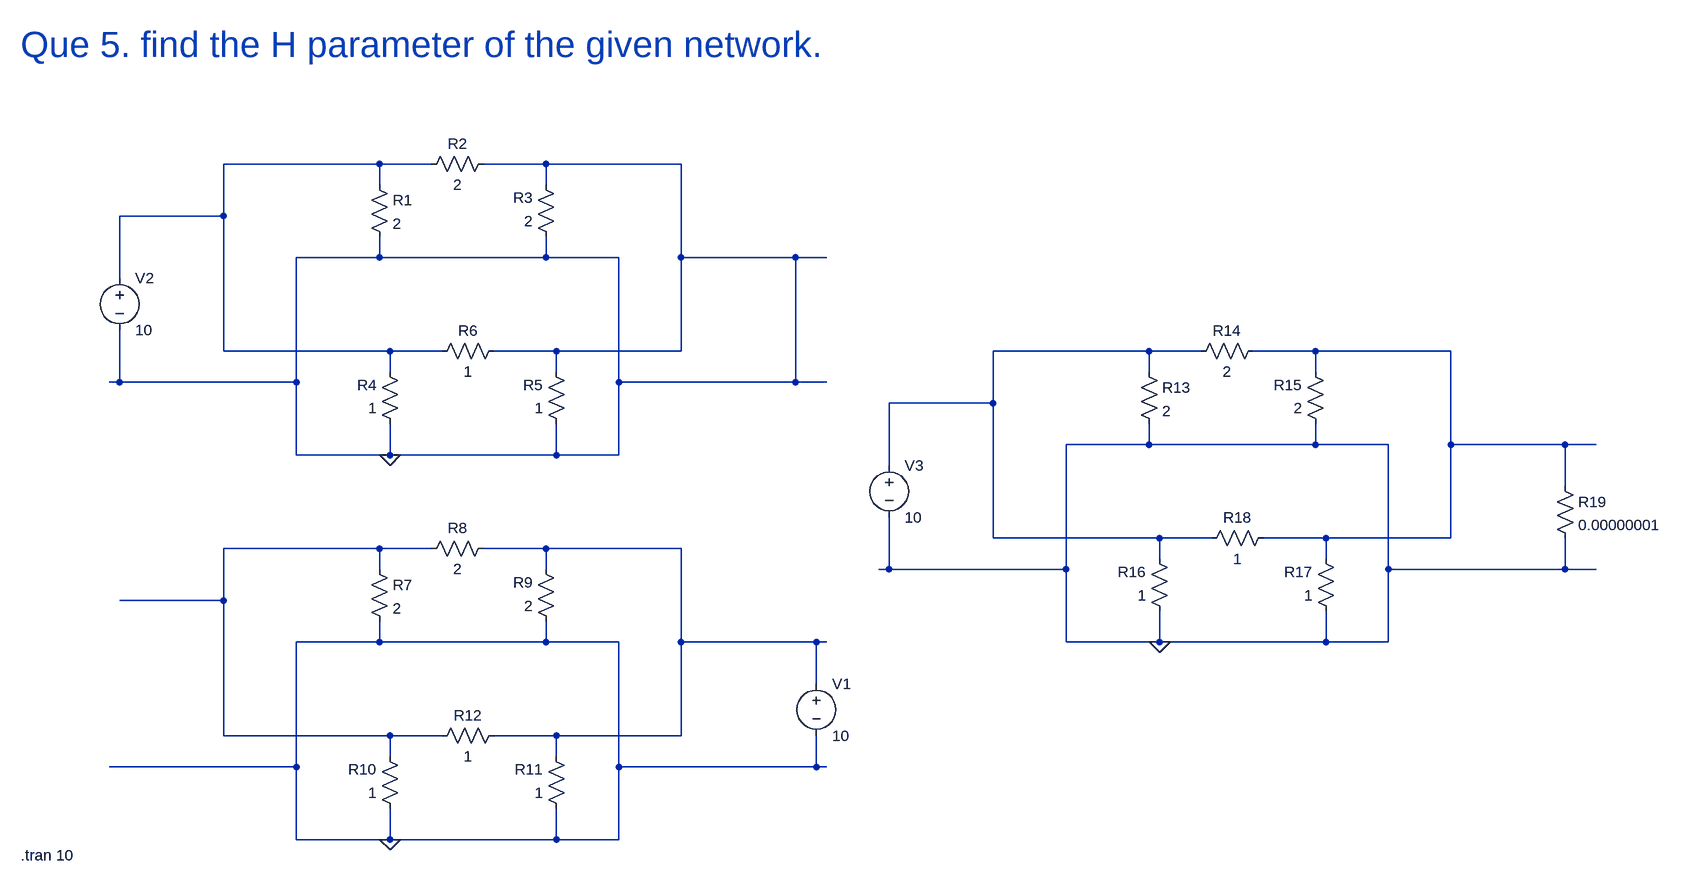
[diagram p0: schematic 5_Dheerendra_23EE019_Two_port_Parallel_H_paramerter.asc]
5_Dheerendra_23EE019_Two_port_Parallel_H_paramerter.asc, the LTspice schematic file:
Version 4
SHEET 1 2020 1048
WIRE 32 -32 -208 -32
WIRE 112 -32 32 -32
WIRE 288 -32 192 -32
WIRE 496 -32 288 -32
WIRE 32 0 32 -32
WIRE 288 0 288 -32
WIRE -208 48 -208 -32
WIRE -208 48 -368 48
WIRE 32 112 32 80
WIRE 32 112 -96 112
WIRE 288 112 288 80
WIRE 288 112 32 112
WIRE 400 112 288 112
WIRE 496 112 496 -32
WIRE 672 112 496 112
WIRE 720 112 672 112
WIRE -368 144 -368 48
WIRE -208 256 -208 48
WIRE 48 256 -208 256
WIRE 128 256 48 256
WIRE 304 256 208 256
WIRE 496 256 496 112
WIRE 496 256 304 256
WIRE 1216 256 976 256
WIRE 1296 256 1216 256
WIRE 1472 256 1376 256
WIRE 1680 256 1472 256
WIRE 48 288 48 256
WIRE 304 288 304 256
WIRE 1216 288 1216 256
WIRE 1472 288 1472 256
WIRE -368 304 -368 224
WIRE -368 304 -384 304
WIRE -96 304 -96 112
WIRE -96 304 -368 304
WIRE 400 304 400 112
WIRE 672 304 672 112
WIRE 672 304 400 304
WIRE 720 304 672 304
WIRE 976 336 976 256
WIRE 976 336 816 336
WIRE 1216 400 1216 368
WIRE 1216 400 1088 400
WIRE 1472 400 1472 368
WIRE 1472 400 1216 400
WIRE 1584 400 1472 400
WIRE 1680 400 1680 256
WIRE 1856 400 1680 400
WIRE 1904 400 1856 400
WIRE -96 416 -96 304
WIRE 48 416 48 368
WIRE 48 416 -96 416
WIRE 304 416 304 368
WIRE 304 416 48 416
WIRE 400 416 400 304
WIRE 400 416 304 416
WIRE 816 432 816 336
WIRE 1856 464 1856 400
WIRE 976 544 976 336
WIRE 1232 544 976 544
WIRE 1312 544 1232 544
WIRE 1488 544 1392 544
WIRE 1680 544 1680 400
WIRE 1680 544 1488 544
WIRE 32 560 -208 560
WIRE 112 560 32 560
WIRE 288 560 192 560
WIRE 496 560 288 560
WIRE 1232 576 1232 544
WIRE 1488 576 1488 544
WIRE 32 592 32 560
WIRE 288 592 288 560
WIRE 816 592 816 512
WIRE 816 592 800 592
WIRE 1088 592 1088 400
WIRE 1088 592 816 592
WIRE 1584 592 1584 400
WIRE 1856 592 1856 544
WIRE 1856 592 1584 592
WIRE 1904 592 1856 592
WIRE -208 640 -208 560
WIRE -208 640 -368 640
WIRE 32 704 32 672
WIRE 32 704 -96 704
WIRE 288 704 288 672
WIRE 288 704 32 704
WIRE 400 704 288 704
WIRE 496 704 496 560
WIRE 704 704 496 704
WIRE 720 704 704 704
WIRE 1088 704 1088 592
WIRE 1232 704 1232 656
WIRE 1232 704 1088 704
WIRE 1488 704 1488 656
WIRE 1488 704 1232 704
WIRE 1584 704 1584 592
WIRE 1584 704 1488 704
WIRE 704 768 704 704
WIRE -208 848 -208 640
WIRE 48 848 -208 848
WIRE 128 848 48 848
WIRE 304 848 208 848
WIRE 496 848 496 704
WIRE 496 848 304 848
WIRE 48 880 48 848
WIRE 304 880 304 848
WIRE -96 896 -96 704
WIRE -96 896 -384 896
WIRE 400 896 400 704
WIRE 704 896 704 848
WIRE 704 896 400 896
WIRE 720 896 704 896
WIRE -96 1008 -96 896
WIRE 48 1008 48 960
WIRE 48 1008 -96 1008
WIRE 304 1008 304 960
WIRE 304 1008 48 1008
WIRE 400 1008 400 896
WIRE 400 1008 304 1008
FLAG 48 416 0
FLAG 48 1008 0
FLAG 1232 704 0
SYMBOL res 16 -16 R0
SYMATTR InstName R1
SYMATTR Value 2
SYMBOL res 208 -48 R90
WINDOW 0 0 56 VBottom 2
WINDOW 3 32 56 VTop 2
SYMATTR InstName R2
SYMATTR Value 2
SYMBOL res 304 96 R180
WINDOW 0 36 76 Left 2
WINDOW 3 36 40 Left 2
SYMATTR InstName R3
SYMATTR Value 2
SYMBOL res 64 384 R180
WINDOW 0 36 76 Left 2
WINDOW 3 36 40 Left 2
SYMATTR InstName R4
SYMATTR Value 1
SYMBOL res 320 384 R180
WINDOW 0 36 76 Left 2
WINDOW 3 36 40 Left 2
SYMATTR InstName R5
SYMATTR Value 1
SYMBOL res 112 272 R270
WINDOW 0 32 56 VTop 2
WINDOW 3 0 56 VBottom 2
SYMATTR InstName R6
SYMATTR Value 1
SYMBOL res 16 576 R0
SYMATTR InstName R7
SYMATTR Value 2
SYMBOL res 208 544 R90
WINDOW 0 0 56 VBottom 2
WINDOW 3 32 56 VTop 2
SYMATTR InstName R8
SYMATTR Value 2
SYMBOL res 304 688 R180
WINDOW 0 36 76 Left 2
WINDOW 3 36 40 Left 2
SYMATTR InstName R9
SYMATTR Value 2
SYMBOL res 64 976 R180
WINDOW 0 36 76 Left 2
WINDOW 3 36 40 Left 2
SYMATTR InstName R10
SYMATTR Value 1
SYMBOL res 320 976 R180
WINDOW 0 36 76 Left 2
WINDOW 3 36 40 Left 2
SYMATTR InstName R11
SYMATTR Value 1
SYMBOL res 112 864 R270
WINDOW 0 32 56 VTop 2
WINDOW 3 0 56 VBottom 2
SYMATTR InstName R12
SYMATTR Value 1
SYMBOL voltage 704 752 R0
WINDOW 123 0 0 Left 0
WINDOW 39 0 0 Left 0
SYMATTR InstName V1
SYMATTR Value 10
SYMBOL voltage -368 128 R0
WINDOW 123 0 0 Left 0
WINDOW 39 0 0 Left 0
SYMATTR InstName V2
SYMATTR Value 10
SYMBOL res 1200 272 R0
SYMATTR InstName R13
SYMATTR Value 2
SYMBOL res 1392 240 R90
WINDOW 0 0 56 VBottom 2
WINDOW 3 32 56 VTop 2
SYMATTR InstName R14
SYMATTR Value 2
SYMBOL res 1488 384 R180
WINDOW 0 36 76 Left 2
WINDOW 3 36 40 Left 2
SYMATTR InstName R15
SYMATTR Value 2
SYMBOL res 1248 672 R180
WINDOW 0 36 76 Left 2
WINDOW 3 36 40 Left 2
SYMATTR InstName R16
SYMATTR Value 1
SYMBOL res 1504 672 R180
WINDOW 0 36 76 Left 2
WINDOW 3 36 40 Left 2
SYMATTR InstName R17
SYMATTR Value 1
SYMBOL res 1296 560 R270
WINDOW 0 32 56 VTop 2
WINDOW 3 0 56 VBottom 2
SYMATTR InstName R18
SYMATTR Value 1
SYMBOL voltage 816 416 R0
WINDOW 123 0 0 Left 0
WINDOW 39 0 0 Left 0
SYMATTR InstName V3
SYMATTR Value 10
SYMBOL res 1840 448 R0
SYMATTR InstName R19
SYMATTR Value 0.00000001
TEXT -520 -216 Left 5 ;Que 5. find the H parameter of the given network.
TEXT -520 1032 Left 2 !.tran 10

The netlist it stands for:
* 5_Dheerendra_23EE019_Two_port_Parallel_H_paramerter.asc
R1 N001 0 2
R2 0 N001 2
R3 0 0 2
R4 0 N001 1
R5 0 0 1
R6 N001 0 1
R7 N004 0 2
R8 N005 N004 2
R9 0 N005 2
R10 0 N004 1
R11 0 N005 1
R12 N004 N005 1
V1 N005 0 10
V2 N001 0 10
R13 N002 0 2
R14 N003 N002 2
R15 0 N003 2
R16 0 N002 1
R17 0 N003 1
R18 N002 N003 1
V3 N002 0 10
R19 N003 0 0.00000001
* Que 5. find the H parameter of the given network.
.tran 10
.backanno
.end